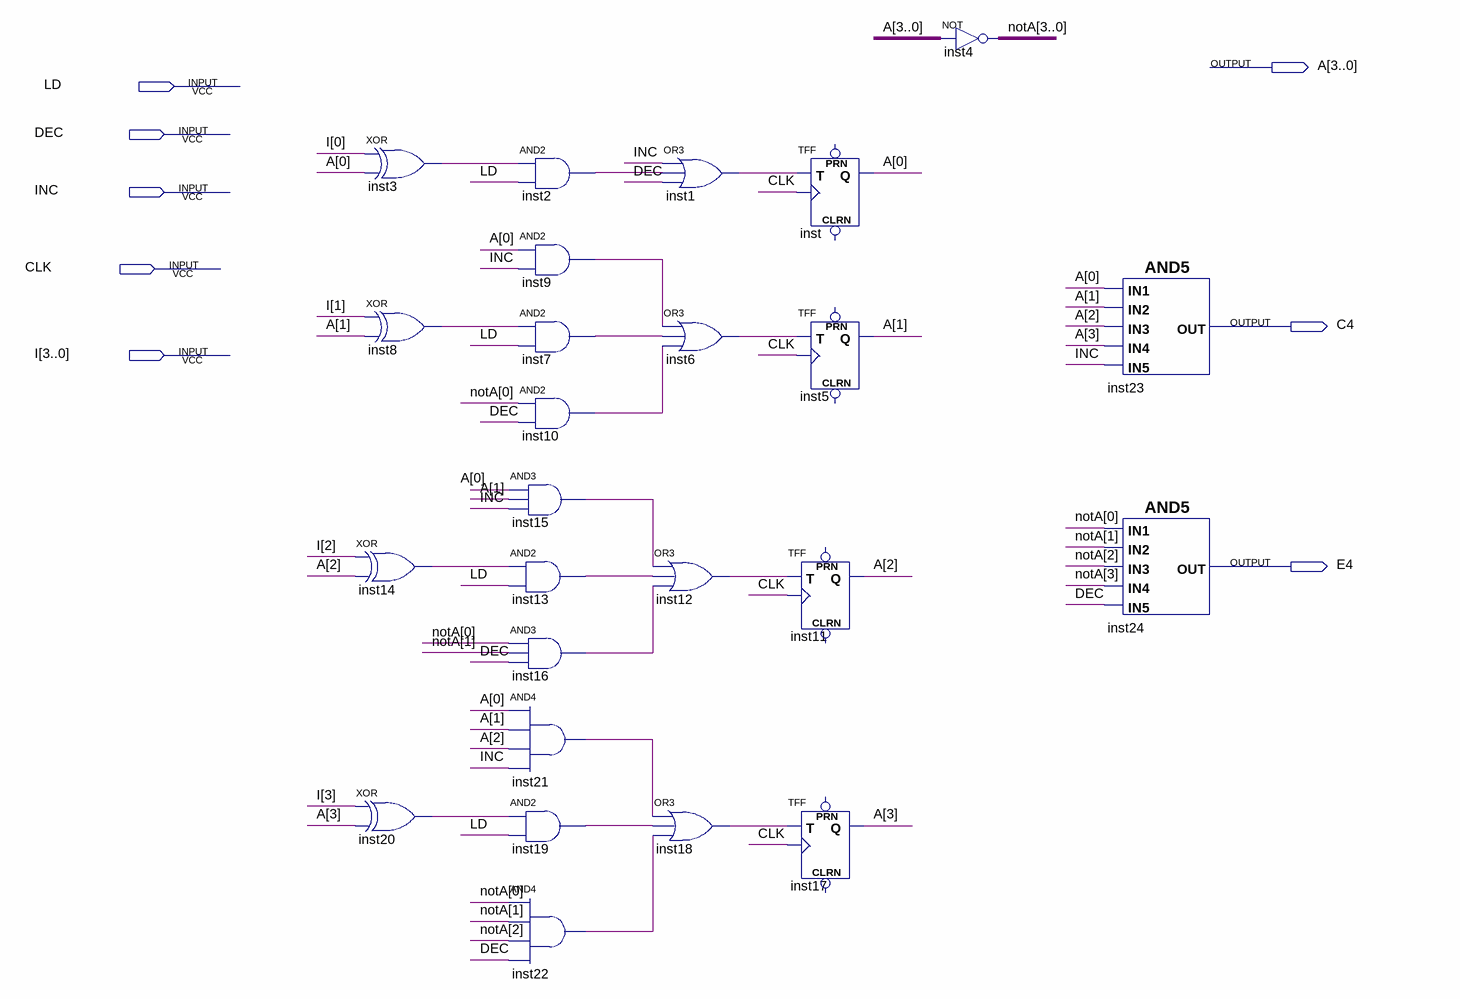
[diagram p0: schematic sheet]
// Quartus schematic REG4_LD_INC_DEC.bdf as structural Verilog: 25 symbols, 8 pins
module REG4_LD_INC_DEC (
  input  LD,
  input  DEC,
  input  INC,
  input  CLK,
  input  [3:0] I,
  output [3:0] A,
  output C4,
  output E4
);

  wire inst1_out, inst2_out, inst3_out, inst6_out, inst7_out, inst8_out, inst9_out, inst10_out, inst12_out,
       inst13_out, inst14_out, inst15_out, inst16_out, inst18_out, inst19_out, inst20_out, inst21_out,
       inst22_out;
  wire [3:0] notA;

  xor inst3 (inst3_out, I[0], A[0]);
  xor inst8 (inst8_out, I[1], A[1]);
  xor inst14 (inst14_out, I[2], A[2]);
  xor inst20 (inst20_out, I[3], A[3]);
  and inst2 (inst2_out, inst3_out, LD);
  and inst9 (inst9_out, A[0], INC);
  and inst7 (inst7_out, inst8_out, LD);
  and inst10 (inst10_out, notA[0], DEC);
  and inst15 (inst15_out, A[0], A[1], INC);
  and inst13 (inst13_out, inst14_out, LD);
  and inst16 (inst16_out, notA[0], notA[1], DEC);
  and inst21 (inst21_out, A[0], A[1], A[2], INC);
  and inst19 (inst19_out, inst20_out, LD);
  and inst22 (inst22_out, notA[0], notA[1], notA[2], DEC);
  or inst1 (inst1_out, INC, inst2_out, DEC);
  or inst6 (inst6_out, inst9_out, inst7_out, inst10_out);
  or inst12 (inst12_out, inst15_out, inst13_out, inst16_out);
  or inst18 (inst18_out, inst21_out, inst19_out, inst22_out);
  TFF inst (.T(inst1_out), .CLK(CLK), .Q(A[0]));  // open: PRN, CLRN
  TFF inst5 (.T(inst6_out), .CLK(CLK), .Q(A[1]));  // open: PRN, CLRN
  TFF inst11 (.T(inst12_out), .CLK(CLK), .Q(A[2]));  // open: PRN, CLRN
  TFF inst17 (.T(inst18_out), .CLK(CLK), .Q(A[3]));  // open: PRN, CLRN
  assign notA = ~A;  // NOT inst4, 4 bits wide
  and inst23 (C4, A[0], A[1], A[2], A[3], INC);
  and inst24 (E4, notA[0], notA[1], notA[2], notA[3], DEC);
endmodule
